# EAGLE schematic Main (EAGLE 9.6.2)
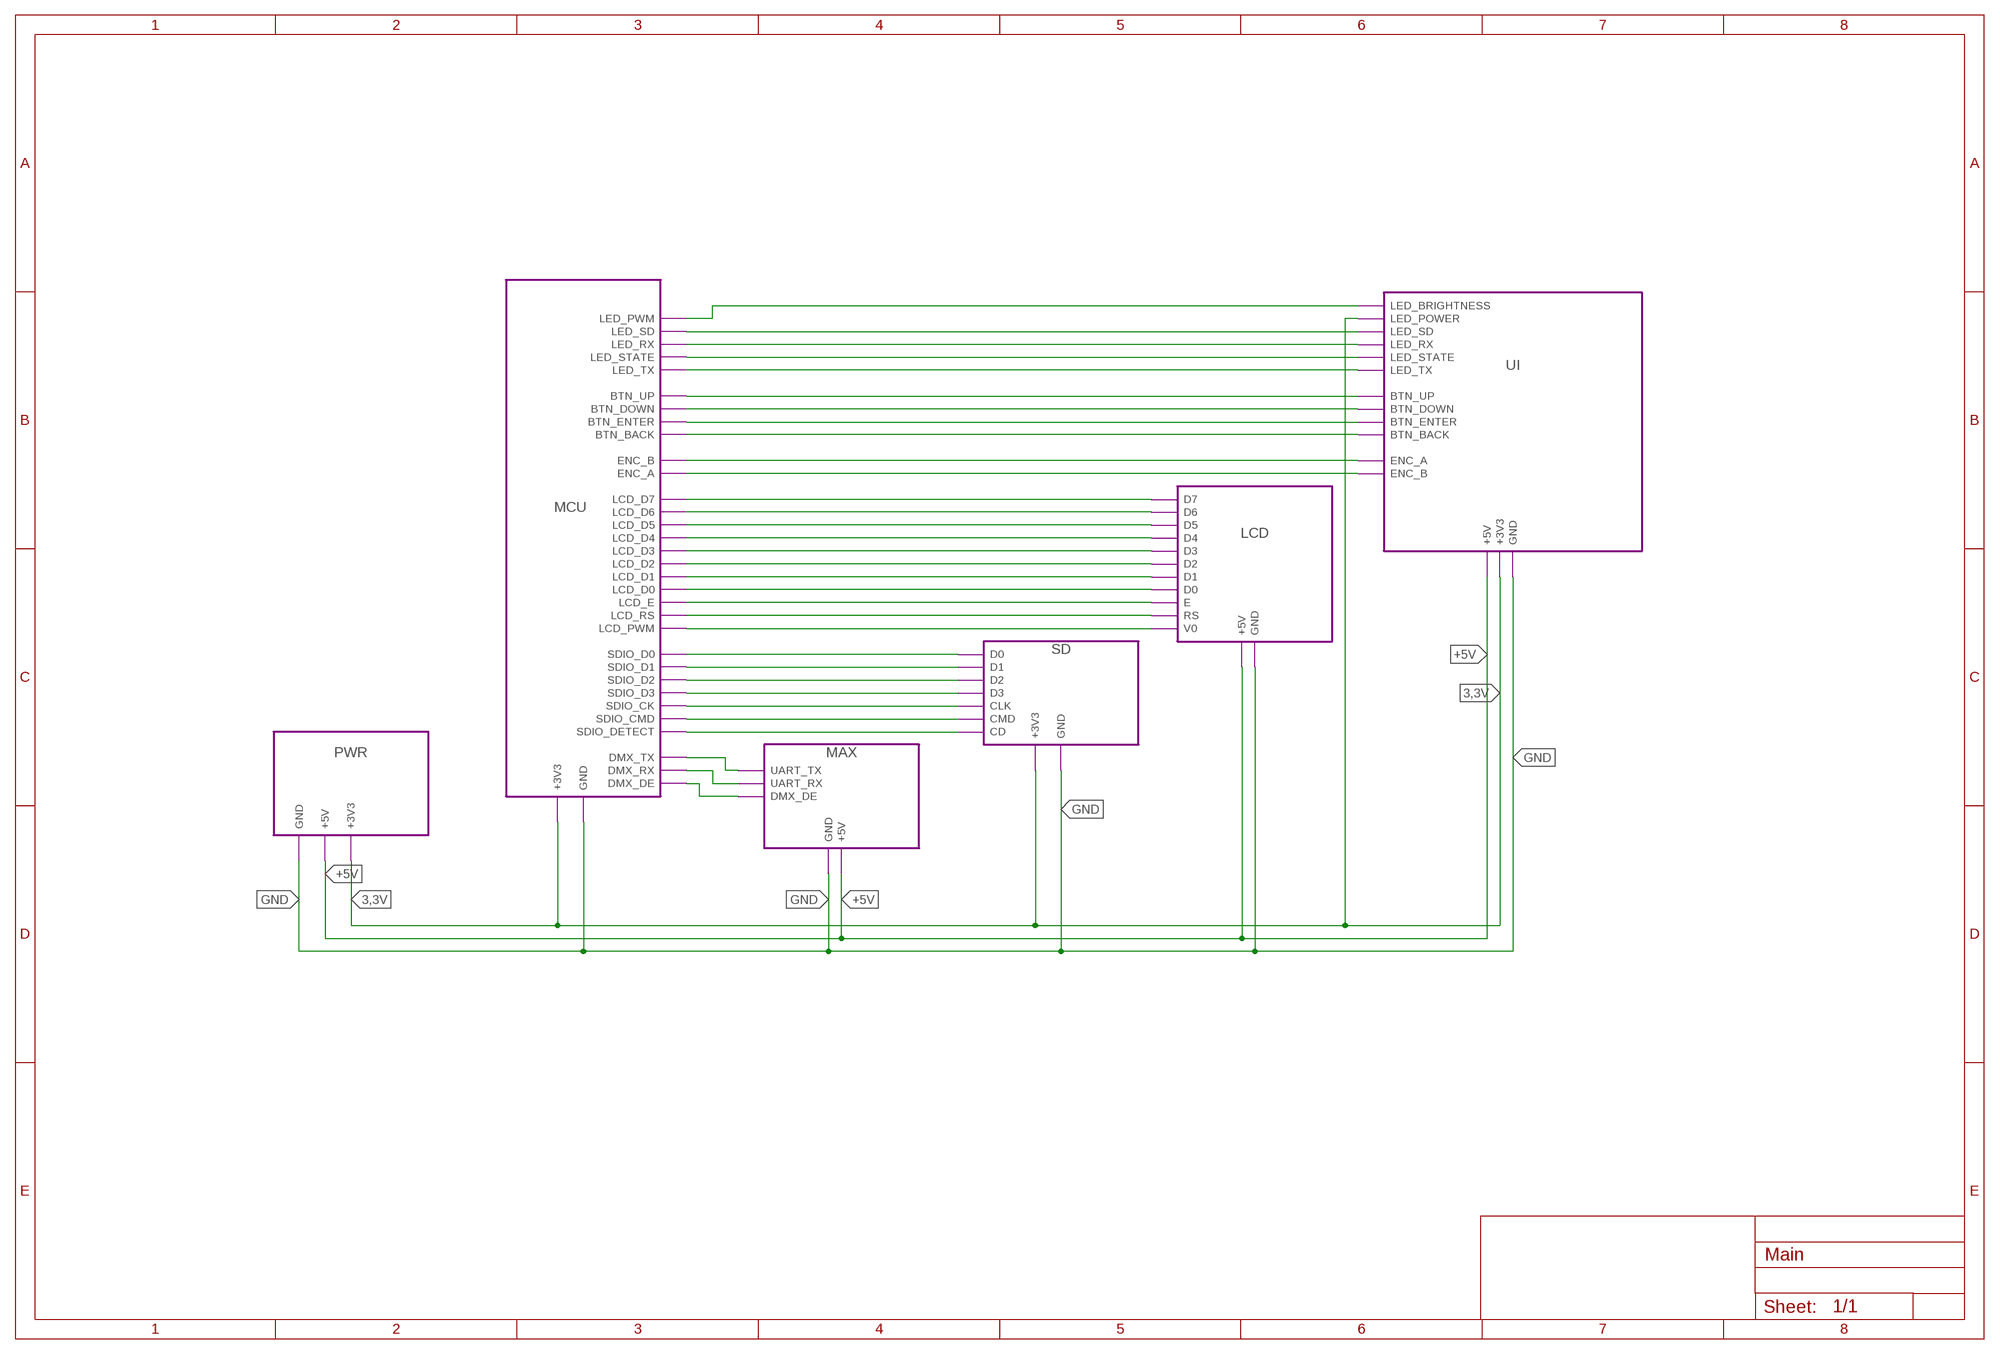
[diagram p0: schematic, sheet 1]

## Module instances
MAX = RS485
PWR = POWER
SD = SD
LCD = LCD
UI = GUI
MCU = F446ZE

## Nets
3,3V: port UI.LED_POWER UI.+3V3 PWR.+3V3 SD.+3V3 MCU.+3V3
+5V: port MAX.+5V UI.+5V LCD.+5V PWR.+5V
GND: port PWR.GND MAX.GND SD.GND UI.GND LCD.GND MCU.GND
N$1: port SD.CMD MCU.SDIO_CMD
N$2: port SD.CLK MCU.SDIO_CK
N$3: port SD.D3 MCU.SDIO_D3
N$4: port MAX.UART_RX MCU.DMX_RX
N$5: port MAX.UART_TX MCU.DMX_TX
N$6: port SD.D2 MCU.SDIO_D2
N$7: port SD.D1 MCU.SDIO_D1
N$8: port SD.D0 MCU.SDIO_D0
N$9: port LCD.V0 MCU.LCD_PWM
N$10: port UI.ENC_B MCU.ENC_A
N$11: port LCD.E MCU.LCD_E
N$12: port LCD.RS MCU.LCD_RS
N$13: port LCD.D0 MCU.LCD_D0
N$14: port LCD.D1 MCU.LCD_D1
N$15: port LCD.D4 MCU.LCD_D4
N$16: port LCD.D5 MCU.LCD_D5
N$17: port LCD.D6 MCU.LCD_D6
N$18: port LCD.D7 MCU.LCD_D7
N$19: port LCD.D2 MCU.LCD_D2
N$20: port LCD.D3 MCU.LCD_D3
N$21: port UI.ENC_A MCU.ENC_B
N$22: port UI.BTN_BACK MCU.BTN_BACK
N$23: port UI.BTN_ENTER MCU.BTN_ENTER
N$24: port UI.BTN_DOWN MCU.BTN_DOWN
N$25: port UI.BTN_UP MCU.BTN_UP
N$26: port MAX.DMX_DE MCU.DMX_DE
N$27: port UI.LED_STATE MCU.LED_STATE
N$28: port UI.LED_BRIGHTNESS MCU.LED_PWM
N$29: port UI.LED_TX MCU.LED_TX
N$30: port UI.LED_RX MCU.LED_RX
N$31: port UI.LED_SD MCU.LED_SD
N$32: port SD.CD MCU.SDIO_DETECT

## Library data of the parts

## Module RS485
Ports: UART_TX(in) UART_RX(out) GND(pwr) +5V(pwr) DMX_DE(in)
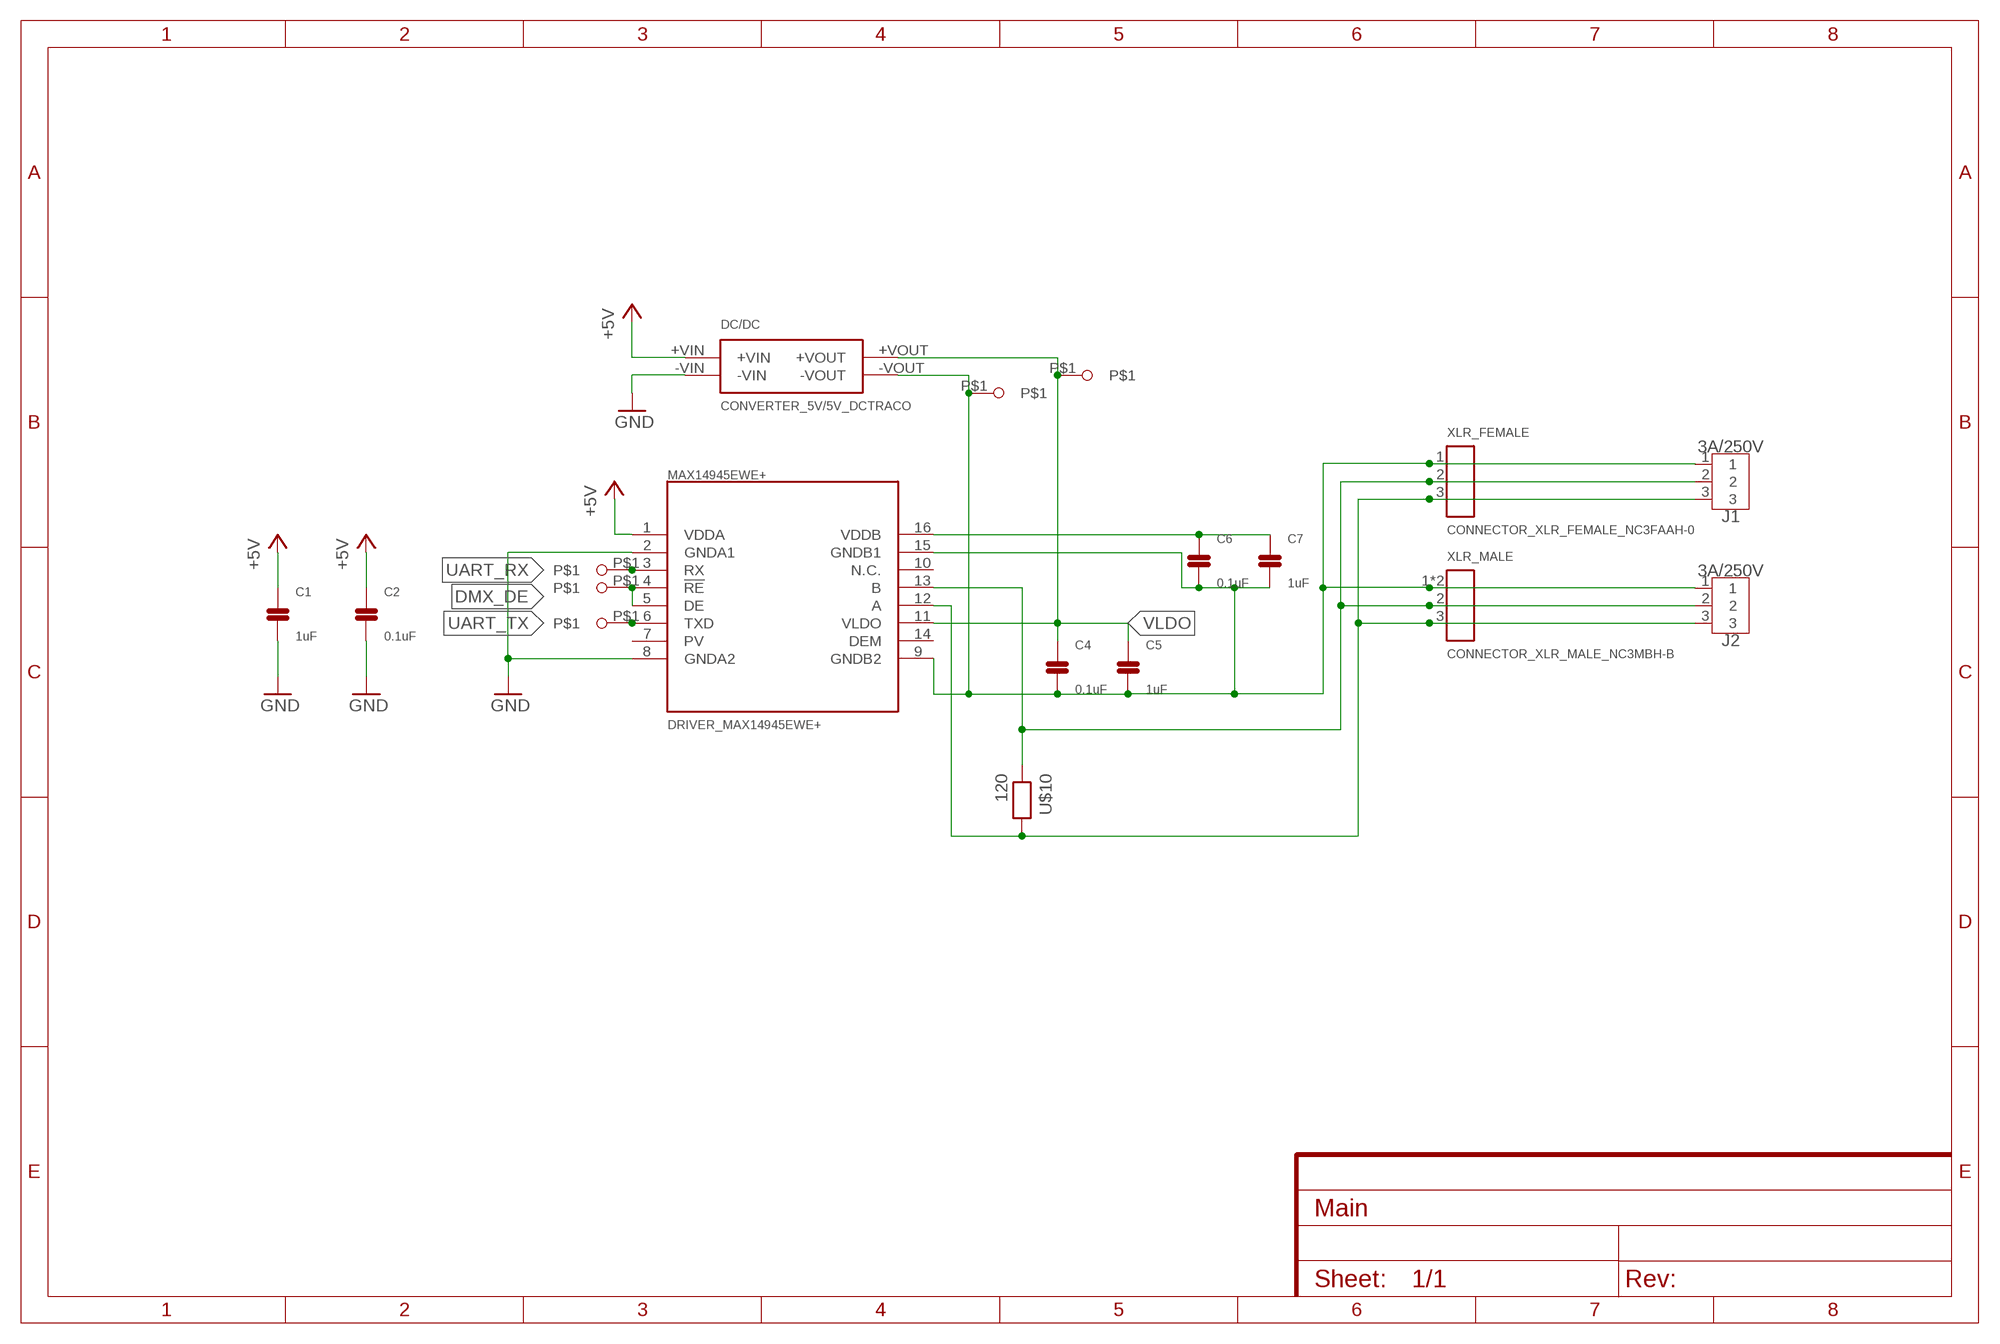
[diagram p1: schematic, module RS485, sheet 1]

### Parts
C1  1uF  CAP_SMD08055C104KAT2A  [CAPC2012X100N]
C2  0.1uF  CAP_SMDC0805C105K4RACTU  [CAPC2012X90N]
C4  0.1uF  CAP_SMDC0805C105K4RACTU  [CAPC2012X90N]
C5  1uF  CAP_SMD08055C104KAT2A  [CAPC2012X100N]
C6  0.1uF  CAP_SMDC0805C105K4RACTU  [CAPC2012X90N]
C7  1uF  CAP_SMD08055C104KAT2A  [CAPC2012X100N]
DC/DC  CONVERTER_5V/5V_DCTRACO  [5V/5V_DC_CONVERTER_TRACO]
J1  3A/250V  B3B-XH-A  [B3B-XH-A]
J2  3A/250V  B3B-XH-A  [B3B-XH-A]
MAX14945EWE+  DRIVER_MAX14945EWE+  DRIVER_MAX14941GWE+  [SOIC127P1032X265-16N]
U$2  MESSPUNKT  [MESSPUNKT]
U$3  MESSPUNKT  [MESSPUNKT]
U$4  MESSPUNKT  [MESSPUNKT]
U$5  MESSPUNKT  [MESSPUNKT]
U$6  MESSPUNKT  [MESSPUNKT]
U$10  120  RES_SMDCRG1206F120R  [RESC3115X56N]
XLR_FEMALE  CONNECTOR_XLR_FEMALE_NC3FAAH-0  [NC3FAAH-0]
XLR_MALE  CONNECTOR_XLR_MALE_NC3MBH-B  [NC3MBH-B]

### Nets
+5V: C1.1 C2.1 DC/DC.+VIN MAX14945EWE+.1(VDDA)
DMX_DE: MAX14945EWE+.4(!RE) MAX14945EWE+.5(DE) U$5.P$1
GND: C1.2 C2.2 DC/DC.-VIN MAX14945EWE+.2(GNDA1) MAX14945EWE+.8(GNDA2)
GNDB: C4.2 C5.2 C6.2 C7.2 DC/DC.-VOUT J1.1 J2.1 MAX14945EWE+.9(GNDB2) MAX14945EWE+.15(GNDB1) U$2.P$1 XLR_FEMALE.1 XLR_MALE.1 XLR_MALE.G
N$1: J1.3 J2.3 MAX14945EWE+.12(A) U$10.1 XLR_FEMALE.3 XLR_MALE.3
N$2: J1.2 J2.2 MAX14945EWE+.13(B) U$10.2 XLR_FEMALE.2 XLR_MALE.2
UART_RX: MAX14945EWE+.3(RX) U$6.P$1
UART_TX: MAX14945EWE+.6(TXD) U$4.P$1
VDDB: C6.1 C7.1 MAX14945EWE+.16(VDDB)
VLDO: C4.1 C5.1 DC/DC.+VOUT MAX14945EWE+.11(VLDO) U$3.P$1
Unconnected: MAX14945EWE+.7(PV) MAX14945EWE+.10(N.C.) MAX14945EWE+.14(DEM)

### Library data of the parts
C1 C5 C7 = BA Parts:CAP_SMD: SMD Kondenatoren; DATASHEET: https://docs.rs-online.com/babb/0900766b817076dd.pdf; PACKAGE: 0805 (2012M)
C2 C4 C6 = BA Parts:CAP_SMD: SMD Kondenatoren; DATASHEET: https://docs.rs-online.com/d3ac/0900766b802d4698.pdf; PACKAGE: 0805 (2012M)
DC/DC = BA Parts:CONVERTER_5V/5V_DC
J1 J2 = BA Parts:B3B-XH-A: XH Connector Top Entry - 3POS Details see: Datasheet <http://www.jst-mfg.com/product/pdf/eng/eXH.pdf>; CATEGORY: CONNECTOR; DESCRIPTION: 2.5mm pitch/disconnectable crimp style connector; MANUFACTURER: JST (XH connector); MPN: B3B-XH-A; PART_STATUS: ACTIVE; ROHS_COMPLIANT: COMPLIANT; SERIES: B3B-XH-A; SUB_CATEGORY: THROUGH HOLE CONNECTOR; TYPE: SIDE ENTRY
MAX14945EWE+ = BA Parts:DRIVER_MAX14941GWE+
U$2-U$6 = BA Parts:MESSPUNKT
U$10 = BA Parts:RES_SMD: SMD Widerstand; DATASHEET: https://docs.rs-online.com/2716/0900766b813e2403.pdf; PACKAGE: 1206 (3216M)
XLR_FEMALE = BA Parts:CONNECTOR_XLR_FEMALE_NC3FAAH-0
XLR_MALE = BA Parts:CONNECTOR_XLR_MALE_NC3MBH-B

## Module POWER
Ports: GND(io) +5V(io) +3V3(io)
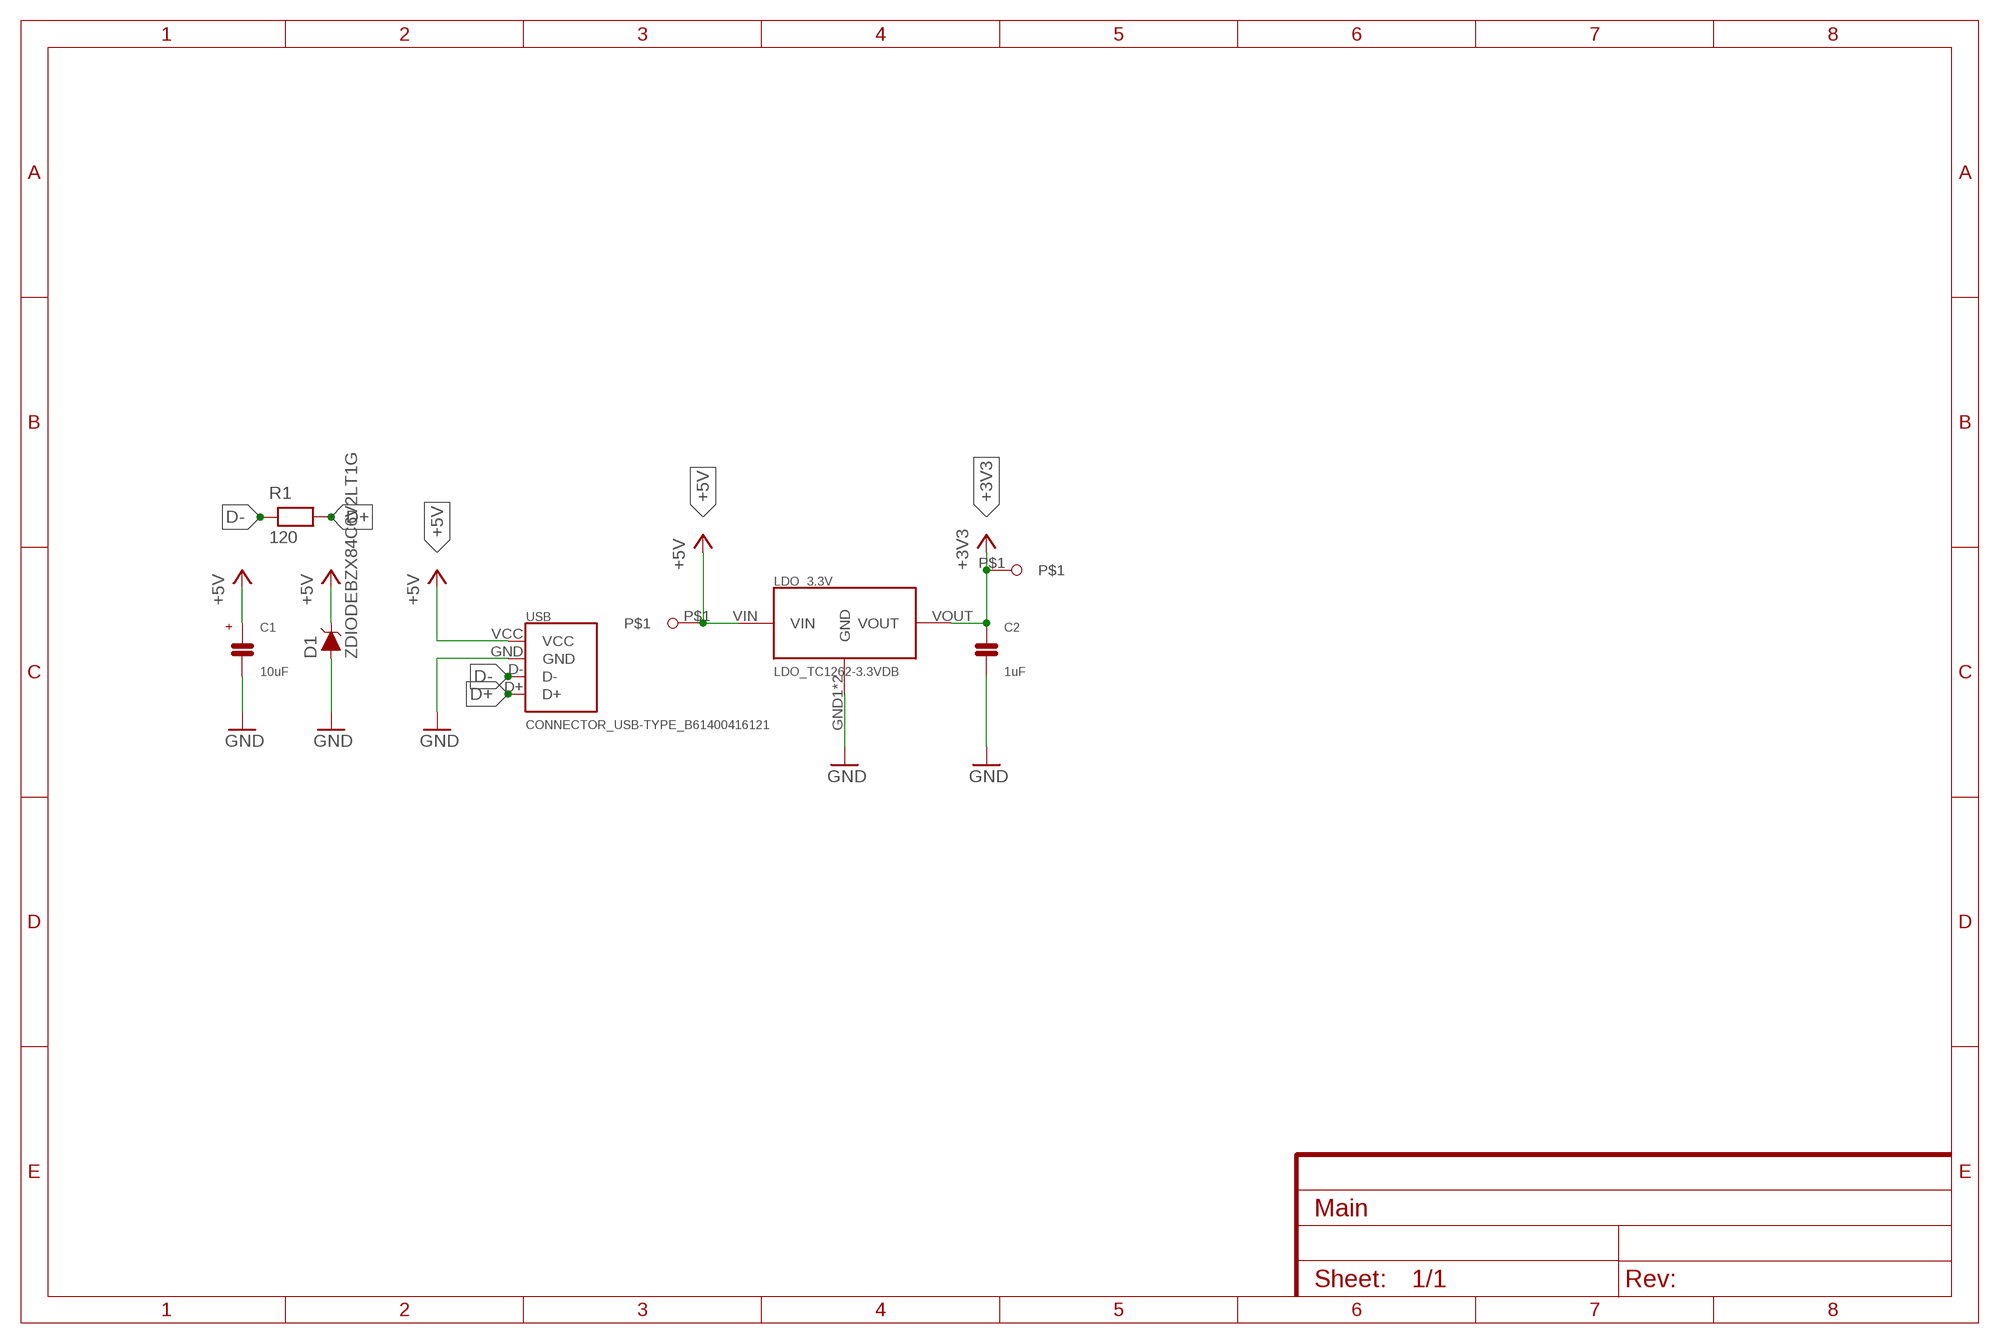
[diagram p2: schematic, module POWER, sheet 1]

### Parts
C1  10uF  CAP_ELEKTROLYTEEEFP1E100AR  [CAPAE430X610N]
C2  1uF  CAP_SMD08055C104KAT2A  [CAPC2012X100N]
D1  ZDIODEBZX84C6V2LT1G  [SOT65P237X111-3N]
LDO_3.3V  LDO_TC1262-3.3VDB  [SOT230P700X180-4N]
R1  120  RES_SMDCRG1206F120R  [RESC3115X56N]
U$5  MESSPUNKT  [MESSPUNKT]
U$6  MESSPUNKT  [MESSPUNKT]
USB  CONNECTOR_USB-TYPE_B61400416121  [USB-TYPE_B_CONNECTOR]

### Nets
+3V3: C2.1 LDO_3.3V.VOUT U$6.P$1
+5V: C1.1 D1.3(C) LDO_3.3V.VIN U$5.P$1 USB.VCC
D+: R1.1 USB.D+
D-: R1.2 USB.D-
GND: C1.2 C2.2 D1.1(A) LDO_3.3V.GND1(GND) LDO_3.3V.GND2(GND) USB.GND

### Library data of the parts
C1 = BA Parts:CAP_ELEKTROLYT; DATASHEET: https://docs.rs-online.com/d3dd/0900766b80df09a1.pdf
C2 = BA Parts:CAP_SMD: SMD Kondenatoren; DATASHEET: https://docs.rs-online.com/babb/0900766b817076dd.pdf; PACKAGE: 0805 (2012M)
D1 = BA Parts:ZDIODE
LDO_3.3V = BA Parts:LDO_TC1262-3.3VDB
R1 = BA Parts:RES_SMD: SMD Widerstand; DATASHEET: https://docs.rs-online.com/2716/0900766b813e2403.pdf; PACKAGE: 1206 (3216M)
U$5 U$6 = BA Parts:MESSPUNKT
USB = BA Parts:CONNECTOR_USB-TYPE_B; DATASHEET: https://docs.rs-online.com/8337/0900766b81023ab5.pdf

## Module SD
Ports: GND(io) D0(io) D1(io) D2(io) CLK(io) CMD(io) CD(io) D3(io) +3V3(io)
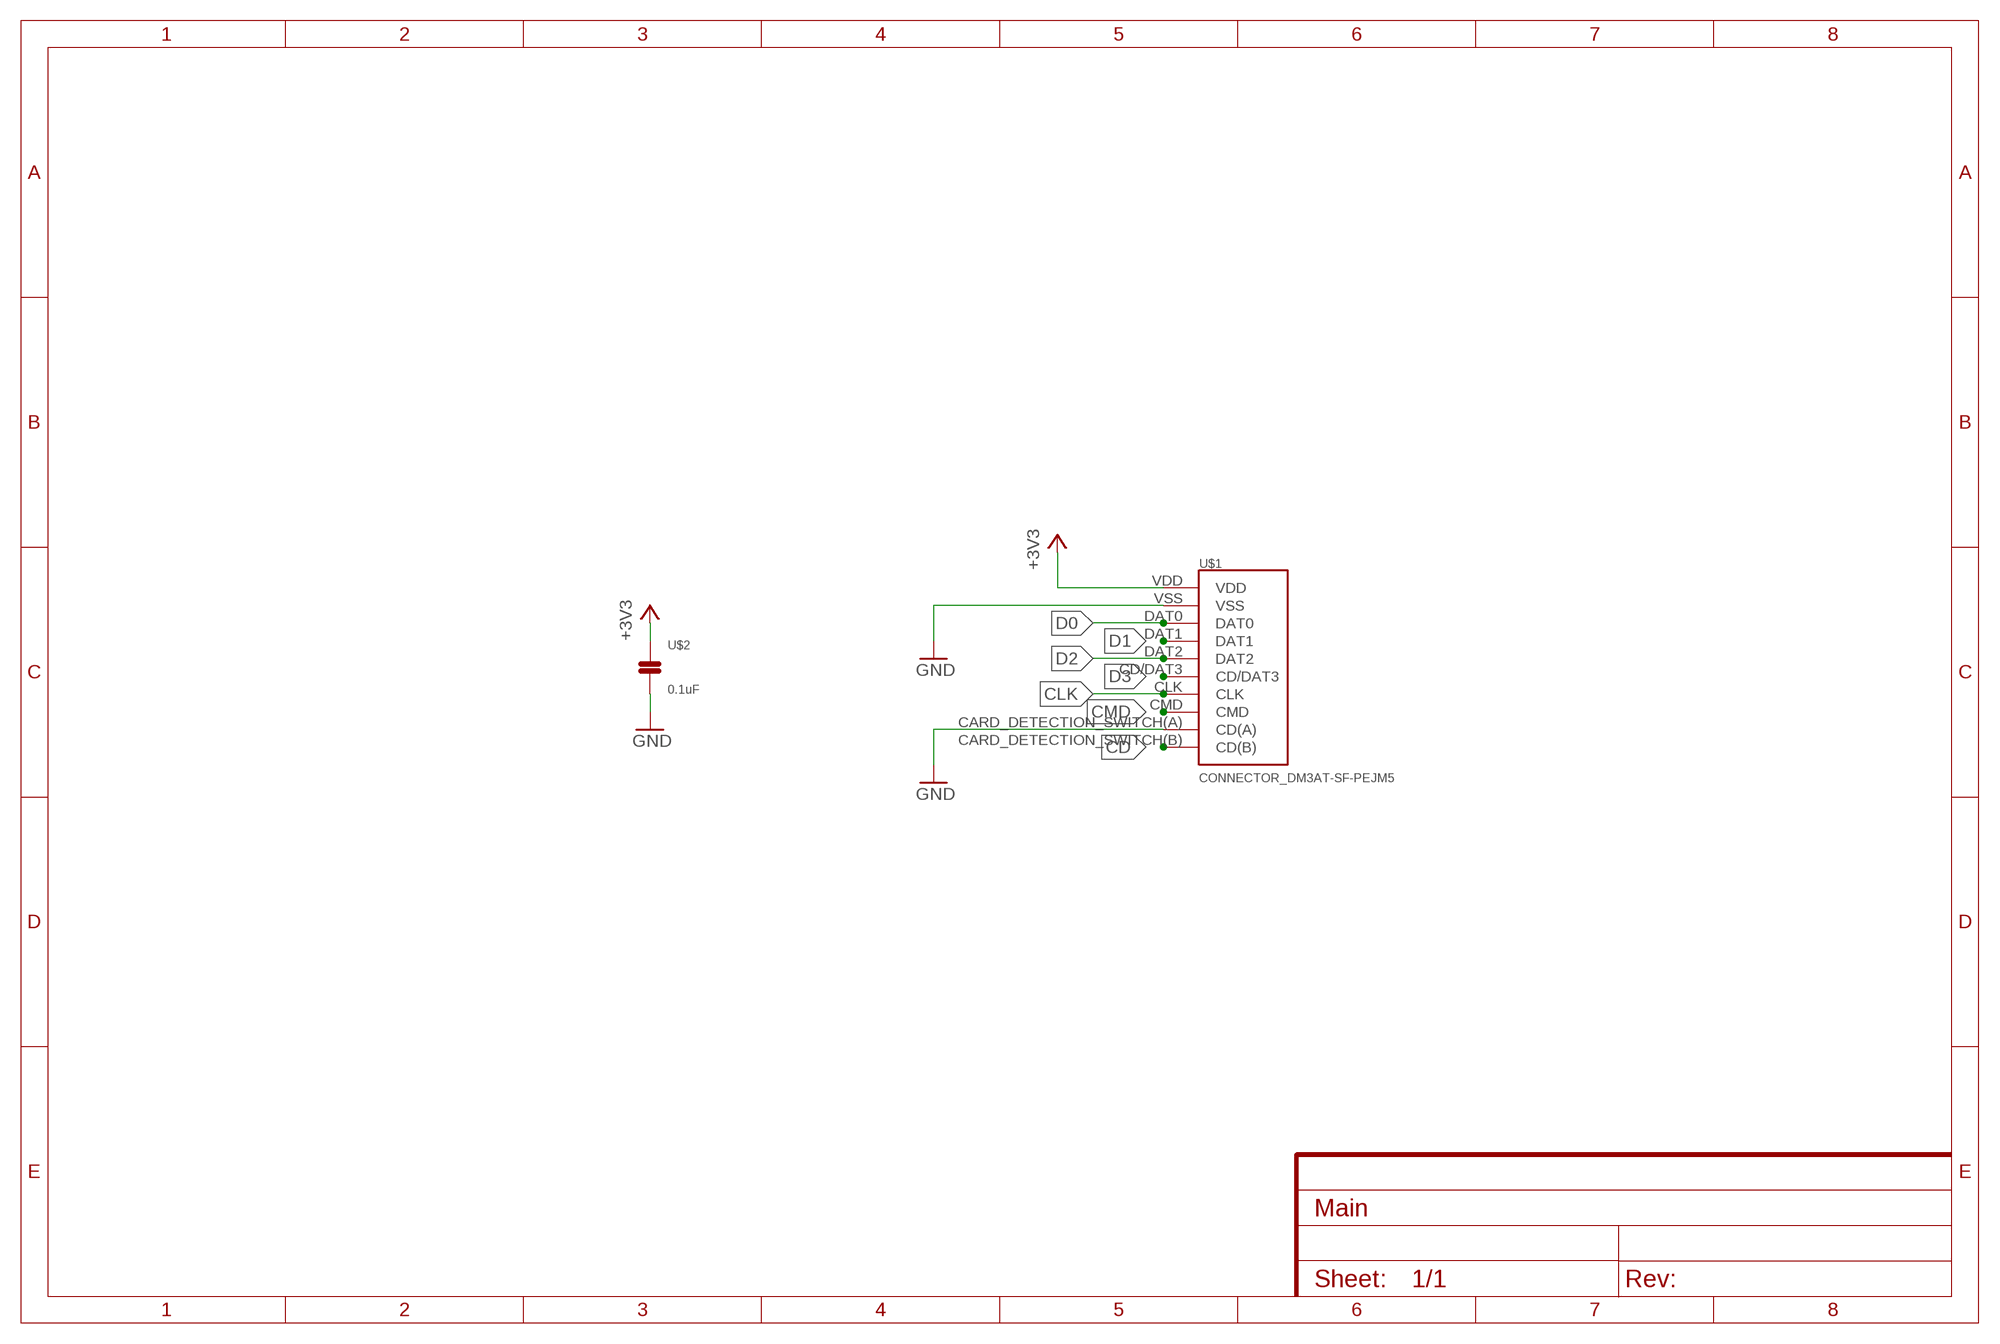
[diagram p3: schematic, module SD, sheet 1]

### Parts
U$1  CONNECTOR_DM3AT-SF-PEJM5  [DM3AT-SF-PEJM5]
U$2  0.1uF  CAP_SMDC0805C105K4RACTU  [CAPC2012X90N]

### Nets
+3V3: U$1.VDD U$2.1
CD: U$1.CARD_DETECTION_SWITCH(B)(CD(B))
CLK: U$1.CLK
CMD: U$1.CMD
D0: U$1.DAT0
D1: U$1.DAT1
D2: U$1.DAT2
D3: U$1.CD/DAT3
GND: U$1.CARD_DETECTION_SWITCH(A)(CD(A)) U$1.VSS U$2.2

### Library data of the parts
U$1 = BA Parts:CONNECTOR_DM3AT-SF-PEJM5
U$2 = BA Parts:CAP_SMD: SMD Kondenatoren; DATASHEET: https://docs.rs-online.com/d3ac/0900766b802d4698.pdf; PACKAGE: 0805 (2012M)

## Module LCD
Ports: D7(io) D6(io) D5(io) D4(io) E(io) RS(io) V0(io) D3(io) D2(io) D1(io) D0(io) +5V(io) GND(io)
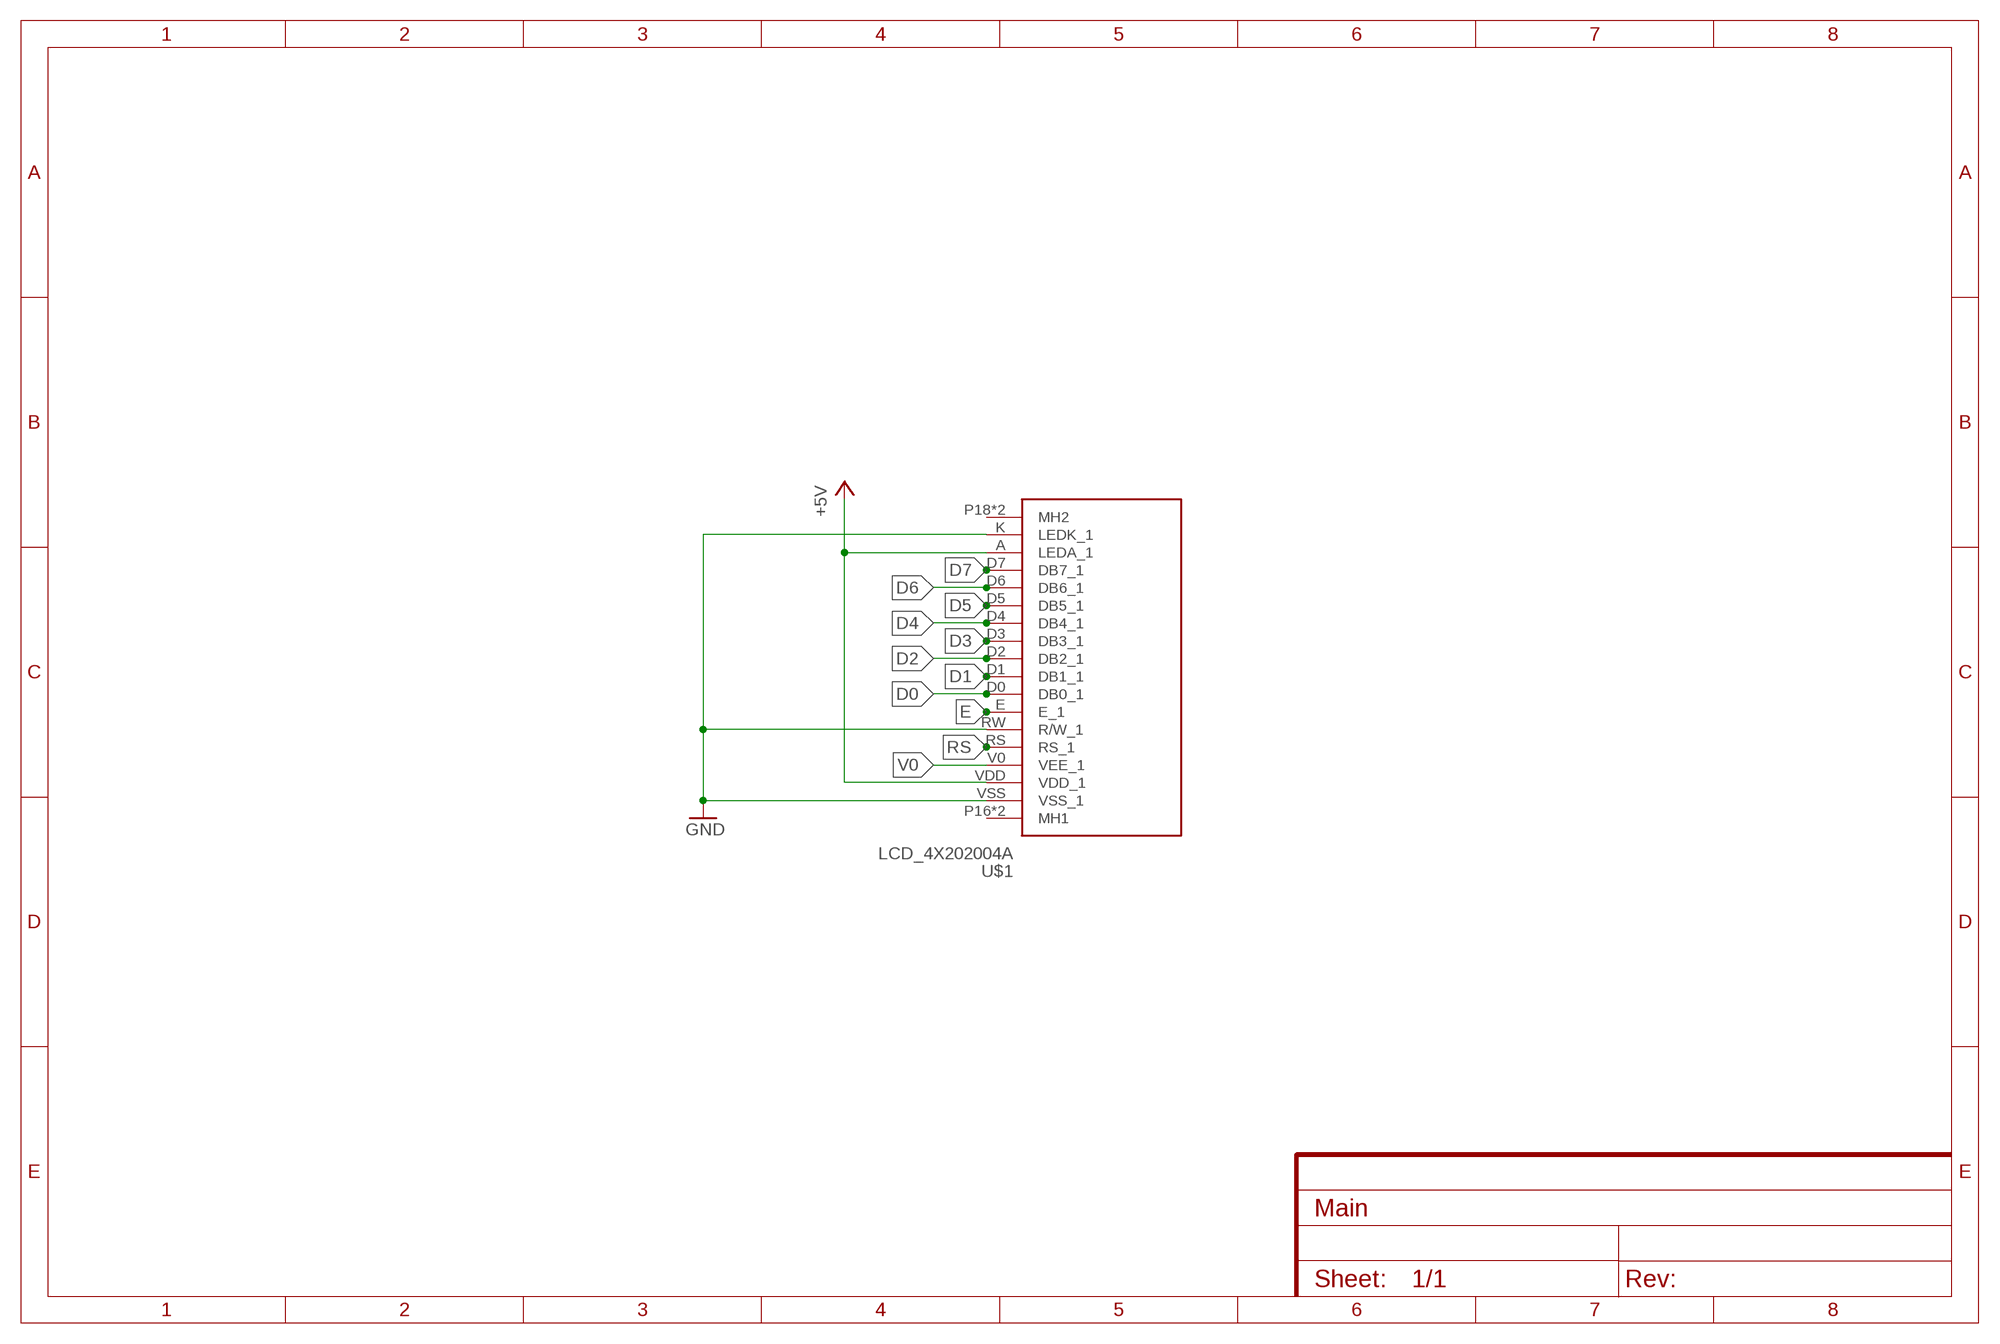
[diagram p4: schematic, module LCD, sheet 1]

### Parts
U$1  LCD_4X202004A  [LCD]

### Nets
+5V: U$1.A(LEDA_1) U$1.VDD(VDD_1)
D0: U$1.D0(DB0_1)
D1: U$1.D1(DB1_1)
D2: U$1.D2(DB2_1)
D3: U$1.D3(DB3_1)
D4: U$1.D4(DB4_1)
D5: U$1.D5(DB5_1)
D6: U$1.D6(DB6_1)
D7: U$1.D7(DB7_1)
E: U$1.E(E_1)
GND: U$1.K(LEDK_1) U$1.RW(R/W_1) U$1.VSS(VSS_1)
RS: U$1.RS(RS_1)
V0: U$1.V0(VEE_1)
Unconnected: U$1.P16(MH1) U$1.P17(MH1) U$1.P18(MH2) U$1.P19(MH2)

### Library data of the parts
U$1 = BA Parts:LCD_4X20

## Module GUI
Ports: BTN_UP(io) BTN_DOWN(io) BTN_ENTER(io) BTN_BACK(io) ENC_A(io) ENC_B(io) GND(io) LED_POWER(io) LED_RX(io) LED_STATE(io) LED_TX(io) LED_SD(io) LED_BRIGHTNESS(io) +5V(io) +3V3(io)
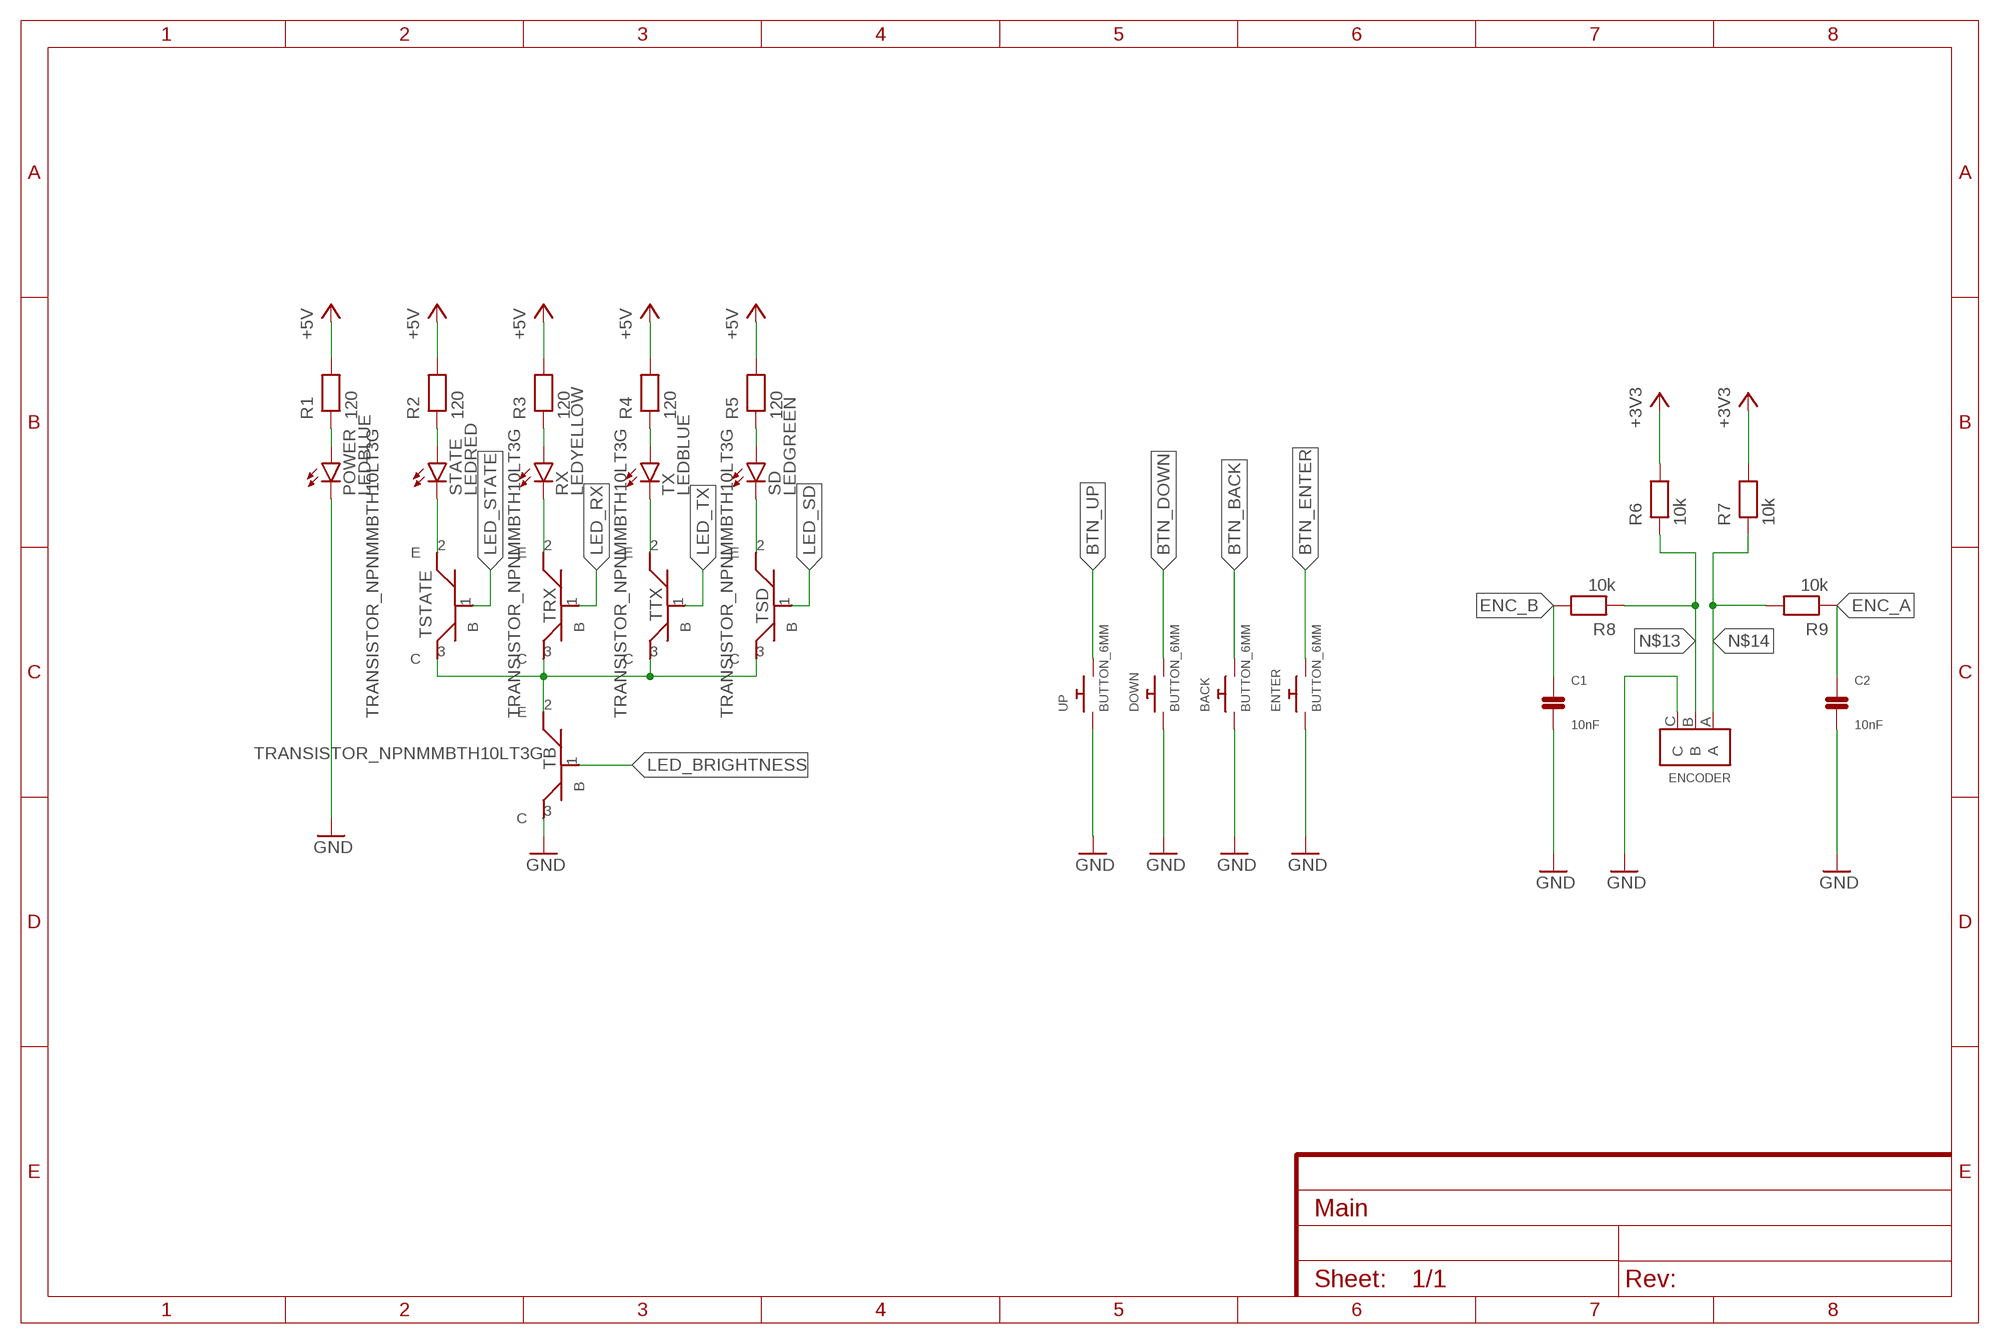
[diagram p5: schematic, module GUI, sheet 1]

### Parts
BACK  BUTTON_6MM  [TACTILE_SWITCH_PTH_6.0MM]
C1  10nF  CAP_SMDVJ0805Y103KXBAC  [CAPC2012X145N]
C2  10nF  CAP_SMDVJ0805Y103KXBAC  [CAPC2012X145N]
DOWN  BUTTON_6MM  [TACTILE_SWITCH_PTH_6.0MM]
ENCODER  ENCODER  [EC12E2420404]
ENTER  BUTTON_6MM  [TACTILE_SWITCH_PTH_6.0MM]
POWER  LEDBLUE  [LED_5MM_BLUE]
R1  120  RES_SMDCRG1206F120R  [RESC3115X56N]
R2  120  RES_SMDCRG1206F120R  [RESC3115X56N]
R3  120  RES_SMDCRG1206F120R  [RESC3115X56N]
R4  120  RES_SMDCRG1206F120R  [RESC3115X56N]
R5  120  RES_SMDCRG1206F120R  [RESC3115X56N]
R6  10k  RES_SMDCRCW080510K0FKEAHP  [RESC1608X55N]
R7  10k  RES_SMDCRCW080510K0FKEAHP  [RESC1608X55N]
R8  10k  RES_SMDCRCW080510K0FKEAHP  [RESC1608X55N]
R9  10k  RES_SMDCRCW080510K0FKEAHP  [RESC1608X55N]
RX  LEDYELLOW  [LED_5MM_YELLOW]
SD  LEDGREEN  [LED_5MM_GREEN]
STATE  LEDRED  [LED_5MM_RED]
TB  TRANSISTOR_NPNMMBTH10LT3G  [SOT95P237X111-3N]
TRX  TRANSISTOR_NPNMMBTH10LT3G  [SOT95P237X111-3N]
TSD  TRANSISTOR_NPNMMBTH10LT3G  [SOT95P237X111-3N]
TSTATE  TRANSISTOR_NPNMMBTH10LT3G  [SOT95P237X111-3N]
TTX  TRANSISTOR_NPNMMBTH10LT3G  [SOT95P237X111-3N]
TX  LEDBLUE  [LED_5MM_BLUE]
UP  BUTTON_6MM  [TACTILE_SWITCH_PTH_6.0MM]

### Nets
+3V3: R6.1 R7.1
+5V: R1.1 R2.1 R3.1 R4.1 R5.1
BTN_BACK: BACK.3 BACK.4
BTN_DOWN: DOWN.3 DOWN.4
BTN_ENTER: ENTER.3 ENTER.4
BTN_UP: UP.3 UP.4
ENC_A: C2.1 R9.2
ENC_B: C1.1 R8.1
GND: BACK.1 BACK.2 C1.2 C2.2 DOWN.1 DOWN.2 ENCODER.C ENTER.1 ENTER.2 POWER.2(C) TB.3(C) UP.1 UP.2
LED_BRIGHTNESS: TB.1(B)
LED_RX: TRX.1(B)
LED_SD: TSD.1(B)
LED_STATE: TSTATE.1(B)
LED_TX: TTX.1(B)
N$1: POWER.1(A) R1.2
N$2: R2.2 STATE.1(A)
N$3: R3.2 RX.1(A)
N$4: R4.2 TX.1(A)
N$7: R5.2 SD.1(A)
N$8: TB.2(E) TRX.3(C) TSD.3(C) TSTATE.3(C) TTX.3(C)
N$9: STATE.2(C) TSTATE.2(E)
N$10: RX.2(C) TRX.2(E)
N$11: TTX.2(E) TX.2(C)
N$12: SD.2(C) TSD.2(E)
N$13: ENCODER.B R6.2 R8.2
N$14: ENCODER.A R7.2 R9.1

### Library data of the parts
BACK DOWN ENTER UP = BA Parts:BUTTON_6MM
C1 C2 = BA Parts:CAP_SMD: SMD Kondenatoren; DATASHEET: https://docs.rs-online.com/16fc/0900766b80117c5f.pdf; PACKAGE: 0805 (2012M)
ENCODER = BA Parts:ENCODER
POWER RX SD STATE TX = BA Parts:LED
R1-R5 = BA Parts:RES_SMD: SMD Widerstand; DATASHEET: https://docs.rs-online.com/2716/0900766b813e2403.pdf; PACKAGE: 1206 (3216M)
R6-R9 = BA Parts:RES_SMD: SMD Widerstand; DATASHEET: https://docs.rs-online.com/e925/0900766b814c54cb.pdf; PACKAGE: 0805 (2012M)
TB TRX TSD TSTATE TTX = BA Parts:TRANSISTOR_NPN

## Module F446ZE
Ports: DMX_DE(io) DMX_RX(io) DMX_TX(io) SDIO_CMD(io) SDIO_CK(io) SDIO_D3(io) SDIO_D2(io) SDIO_D1(io) SDIO_D0(io) LCD_RS(io) LCD_E(io) LCD_D0(io) LCD_D1(io) LCD_D2(io) LCD_D3(io) LCD_D4(io) LCD_D5(io) LCD_D6(io) LCD_D7(io) ENC_A(io) ENC_B(io) BTN_BACK(io) BTN_ENTER(io) BTN_DOWN(io) BTN_UP(io) LED_TX(io) LED_STATE(io) LED_RX(io) LED_SD(io) LCD_PWM(io) LED_PWM(io) GND(io) +3V3(io) SDIO_DETECT(io)
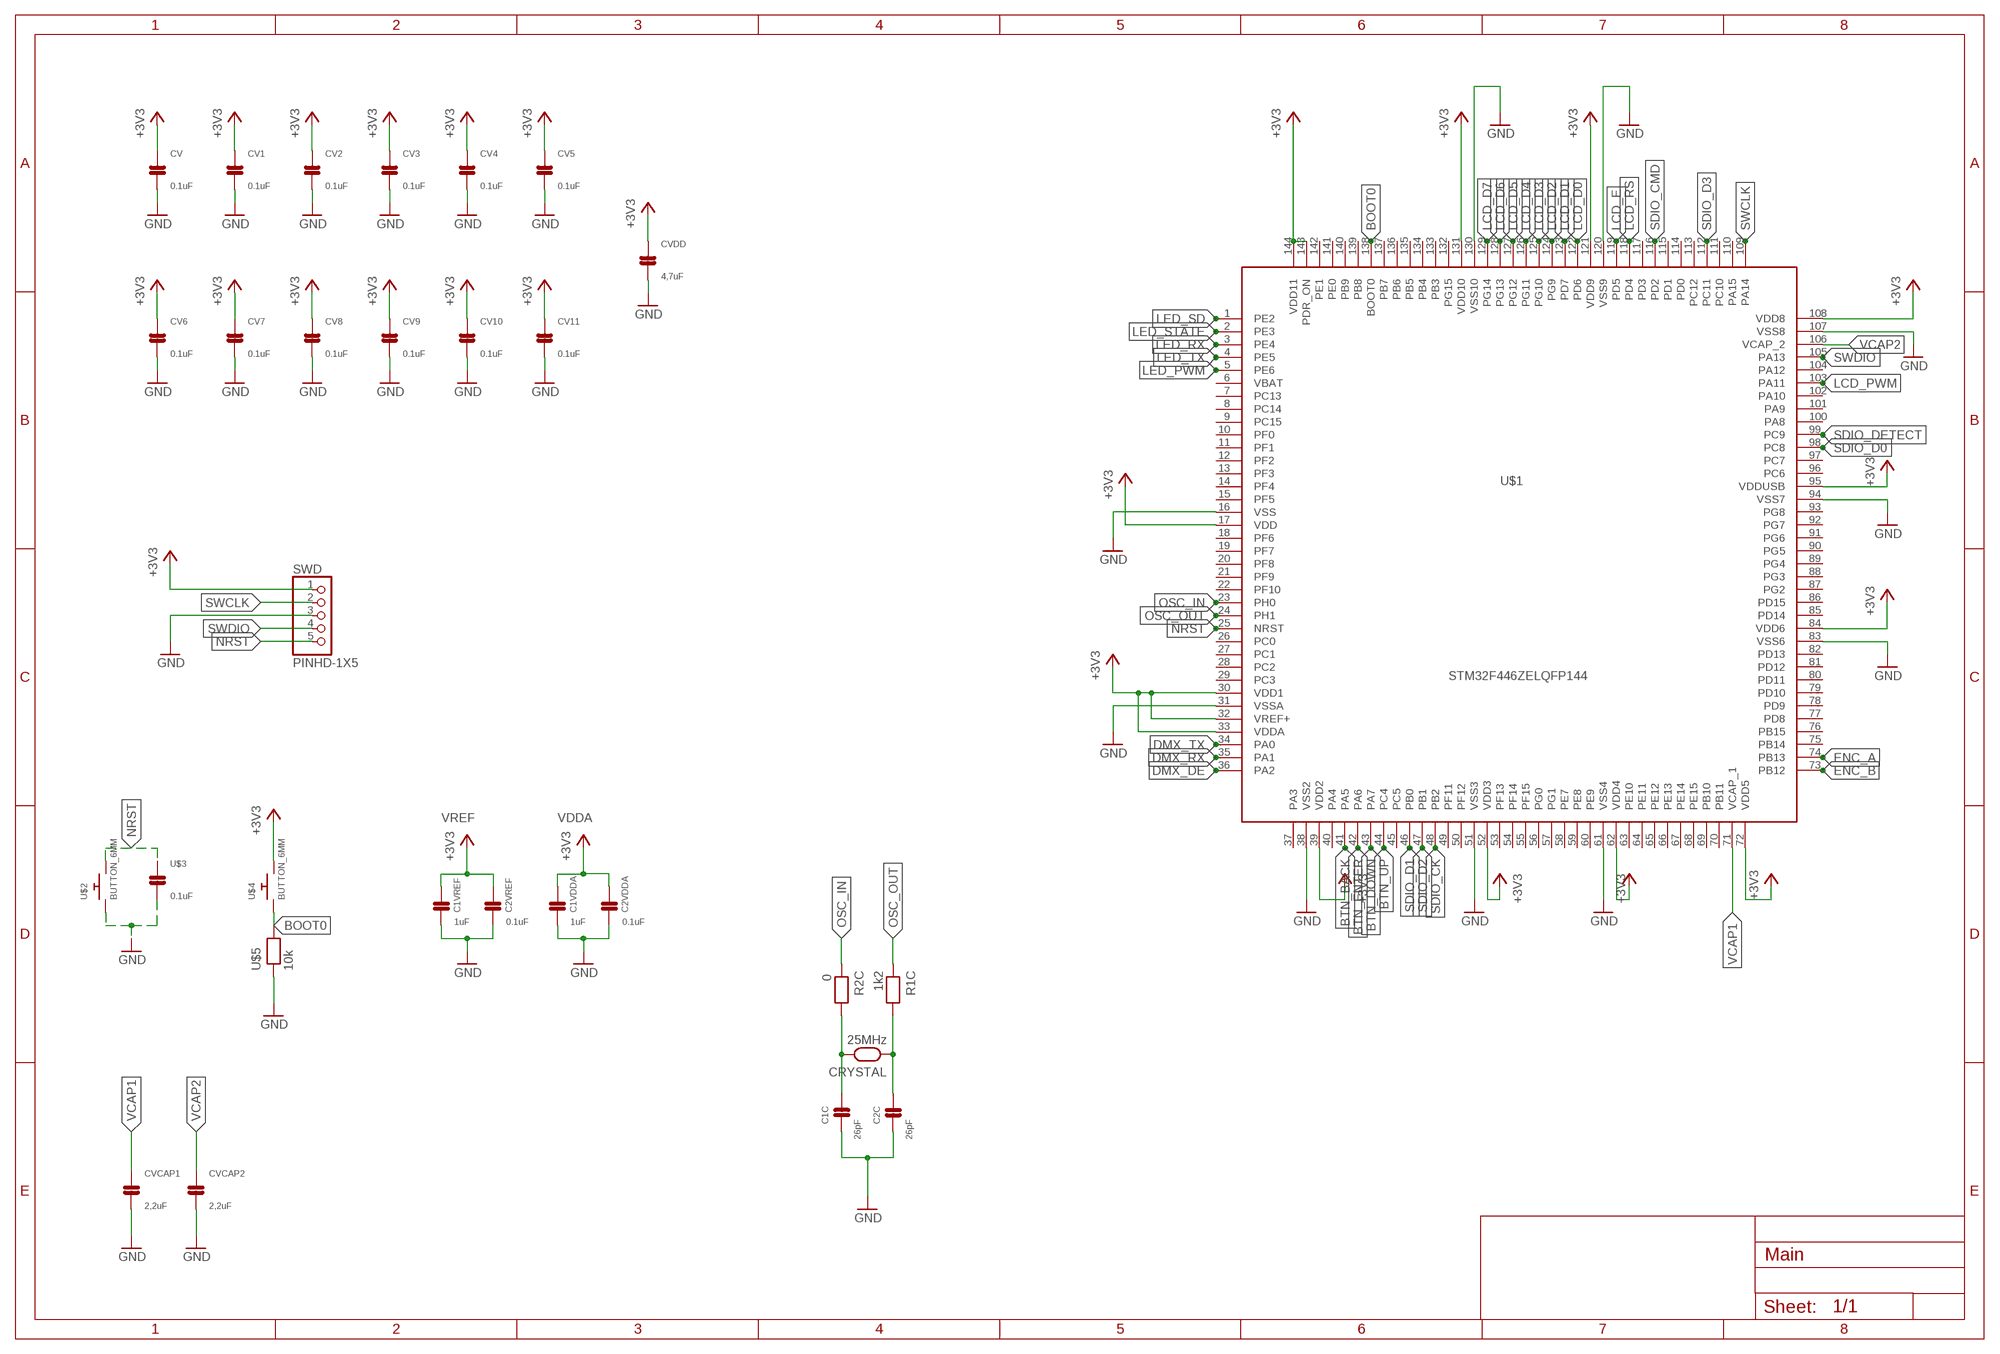
[diagram p6: schematic, module F446ZE, sheet 1]

### Parts
C1C  26pF  CAP_SMDVJ0603A150JXBAC  [CAPC1608X97N]
C1VDDA  1uF  CAP_SMD08055C104KAT2A  [CAPC2012X100N]
C1VREF  1uF  CAP_SMD08055C104KAT2A  [CAPC2012X100N]
C2C  26pF  CAP_SMDVJ0603A150JXBAC  [CAPC1608X97N]
C2VDDA  0.1uF  CAP_SMDC0805C105K4RACTU  [CAPC2012X90N]
C2VREF  0.1uF  CAP_SMDC0805C105K4RACTU  [CAPC2012X90N]
CRYSTAL  25MHz  CRYSTAL_VJ0603A150JXBACVJ0603A150JXBAC  [XTALRR488W43L1077T434H350B]
CV  0.1uF  CAP_SMDC0805C105K4RACTU  [CAPC2012X90N]
CV1  0.1uF  CAP_SMDC0805C105K4RACTU  [CAPC2012X90N]
CV2  0.1uF  CAP_SMDC0805C105K4RACTU  [CAPC2012X90N]
CV3  0.1uF  CAP_SMDC0805C105K4RACTU  [CAPC2012X90N]
CV4  0.1uF  CAP_SMDC0805C105K4RACTU  [CAPC2012X90N]
CV5  0.1uF  CAP_SMDC0805C105K4RACTU  [CAPC2012X90N]
CV6  0.1uF  CAP_SMDC0805C105K4RACTU  [CAPC2012X90N]
CV7  0.1uF  CAP_SMDC0805C105K4RACTU  [CAPC2012X90N]
CV8  0.1uF  CAP_SMDC0805C105K4RACTU  [CAPC2012X90N]
CV9  0.1uF  CAP_SMDC0805C105K4RACTU  [CAPC2012X90N]
CV10  0.1uF  CAP_SMDC0805C105K4RACTU  [CAPC2012X90N]
CV11  0.1uF  CAP_SMDC0805C105K4RACTU  [CAPC2012X90N]
CVCAP1  2,2uF  CAP_SMDC0603C225K4PACTU  [CAPC1608X90N]
CVCAP2  2,2uF  CAP_SMDC0603C225K4PACTU  [CAPC1608X90N]
CVDD  4,7uF  CAP_SMDC0805C475M8RACAUTO  [CAPC2012X140N]
R1C  1k2  RES_SMDCRCW080510K0FKEAHP  [RESC1608X55N]
R2C  0  RES_SMDCRCW080510K0FKEAHP  [RESC1608X55N]
SWD  PINHD-1X5  [1X05]
U$1  STM32F446ZELQFP144  [QFP50P2200X2200X160-144N]
U$2  BUTTON_6MM  [TACTILE_SWITCH_PTH_6.0MM]
U$3  0.1uF  CAP_SMDC0805C105K4RACTU  [CAPC2012X90N]
U$4  BUTTON_6MM  [TACTILE_SWITCH_PTH_6.0MM]
U$5  10k  RES_SMDCRCW080510K0FKEAHP  [RESC1608X55N]

### Nets
+3V3: C1VDDA.1 C1VREF.1 C2VDDA.1 C2VREF.1 CV1.1 CV2.1 CV3.1 CV4.1 CV5.1 CV6.1 CV7.1 CV8.1 CV9.1 CV10.1 CV11.1 CV.1 CVDD.1 SWD.1 U$1.17(VDD) U$1.30(VDD1) U$1.32(VREF+) U$1.33(VDDA) U$1.39(VDD2) U$1.52(VDD3) U$1.62(VDD4) U$1.72(VDD5) U$1.84(VDD6) U$1.95(VDDUSB) U$1.108(VDD8) U$1.121(VDD9) U$1.131(VDD10) U$1.143(PDR_ON) U$1.144(VDD11) U$4.3 U$4.4
BOOT0: U$1.138(BOOT0) U$4.1 U$4.2 U$5.1
BTN_BACK: U$1.41(PA5)
BTN_DOWN: U$1.43(PA7)
BTN_ENTER: U$1.42(PA6)
BTN_UP: U$1.44(PC4)
DMX_DE: U$1.36(PA2)
DMX_RX: U$1.35(PA1)
DMX_TX: U$1.34(PA0)
ENC_A: U$1.74(PB13)
ENC_B: U$1.73(PB12)
GND: C1C.1 C1VDDA.2 C1VREF.2 C2C.2 C2VDDA.2 C2VREF.2 CV1.2 CV2.2 CV3.2 CV4.2 CV5.2 CV6.2 CV7.2 CV8.2 CV9.2 CV10.2 CV11.2 CV.2 CVCAP1.2 CVCAP2.2 CVDD.2 SWD.3 U$1.16(VSS) U$1.31(VSSA) U$1.38(VSS2) U$1.51(VSS3) U$1.61(VSS4) U$1.83(VSS6) U$1.94(VSS7) U$1.107(VSS8) U$1.120(VSS9) U$1.130(VSS10) U$2.1 U$2.2 U$3.2 U$5.2
LCD_D0: U$1.122(PD6)
LCD_D1: U$1.123(PD7)
LCD_D2: U$1.124(PG9)
LCD_D3: U$1.125(PG10)
LCD_D4: U$1.126(PG11)
LCD_D5: U$1.127(PG12)
LCD_D6: U$1.128(PG13)
LCD_D7: U$1.129(PG14)
LCD_E: U$1.119(PD5)
LCD_PWM: U$1.103(PA11)
LCD_RS: U$1.118(PD4)
LED_PWM: U$1.5(PE6)
LED_RX: U$1.3(PE4)
LED_SD: U$1.1(PE2)
LED_STATE: U$1.2(PE3)
LED_TX: U$1.4(PE5)
N$2: C1C.2 CRYSTAL.1 R2C.1
N$6: C2C.1 CRYSTAL.2 R1C.1
NRST: SWD.5 U$1.25(NRST) U$2.3 U$2.4 U$3.1
OSC_IN: R2C.2 U$1.23(PH0)
OSC_OUT: R1C.2 U$1.24(PH1)
SDIO_CK: U$1.48(PB2)
SDIO_CMD: U$1.116(PD2)
SDIO_D0: U$1.98(PC8)
SDIO_D1: U$1.46(PB0)
SDIO_D2: U$1.47(PB1)
SDIO_D3: U$1.112(PC11)
SDIO_DETECT: U$1.99(PC9)
SWCLK: SWD.2 U$1.109(PA14)
SWDIO: SWD.4 U$1.105(PA13)
VCAP1: CVCAP1.1 U$1.71(VCAP_1)
VCAP2: CVCAP2.1 U$1.106(VCAP_2)
Unconnected: U$1.6(VBAT) U$1.7(PC13) U$1.8(PC14) U$1.9(PC15) U$1.10(PF0) U$1.11(PF1) U$1.12(PF2) U$1.13(PF3) U$1.14(PF4) U$1.15(PF5) U$1.18(PF6) U$1.19(PF7) U$1.20(PF8) U$1.21(PF9) U$1.22(PF10) U$1.26(PC0) U$1.27(PC1) U$1.28(PC2) U$1.29(PC3) U$1.37(PA3) U$1.40(PA4) U$1.45(PC5) U$1.49(PF11) U$1.50(PF12) U$1.53(PF13) U$1.54(PF14) U$1.55(PF15) U$1.56(PG0) U$1.57(PG1) U$1.58(PE7) U$1.59(PE8) U$1.60(PE9) U$1.63(PE10) U$1.64(PE11) U$1.65(PE12) U$1.66(PE13) U$1.67(PE14) U$1.68(PE15) U$1.69(PB10) U$1.70(PB11) U$1.75(PB14) U$1.76(PB15) U$1.77(PD8) U$1.78(PD9) U$1.79(PD10) U$1.80(PD11) U$1.81(PD12) U$1.82(PD13) U$1.85(PD14) U$1.86(PD15) U$1.87(PG2) U$1.88(PG3) U$1.89(PG4) U$1.90(PG5) U$1.91(PG6) U$1.92(PG7) U$1.93(PG8) U$1.96(PC6) U$1.97(PC7) U$1.100(PA8) U$1.101(PA9) U$1.102(PA10) U$1.104(PA12) U$1.110(PA15) U$1.111(PC10) U$1.113(PC12) U$1.114(PD0) U$1.115(PD1) U$1.117(PD3) U$1.132(PG15) U$1.133(PB3) U$1.134(PB4) U$1.135(PB5) U$1.136(PB6) U$1.137(PB7) U$1.139(PB8) U$1.140(PB9) U$1.141(PE0) U$1.142(PE1)

### Notes on the sheet
- VREF | VDDA

### Library data of the parts
C1C C2C = BA Parts:CAP_SMD: SMD Kondenatoren; DATASHEET: https://docs.rs-online.com/16fc/0900766b80117c5f.pdf; PACKAGE: 0603; VALUE: 15pF
C1VDDA C1VREF = BA Parts:CAP_SMD: SMD Kondenatoren; DATASHEET: https://docs.rs-online.com/babb/0900766b817076dd.pdf; PACKAGE: 0805 (2012M)
C2VDDA C2VREF CV CV1-CV11 U$3 = BA Parts:CAP_SMD: SMD Kondenatoren; DATASHEET: https://docs.rs-online.com/d3ac/0900766b802d4698.pdf; PACKAGE: 0805 (2012M)
CRYSTAL = BA Parts:CRYSTAL_VJ0603A150JXBAC; DATASHEET: https://docs.rs-online.com/4d75/0900766b80dbbbbd.pdf; FREQ: 25MHz
CVCAP1 CVCAP2 = BA Parts:CAP_SMD: SMD Kondenatoren; DATASHEET: https://docs.rs-online.com/abc5/0900766b816ffde5.pdf; PACKAGE: 0603 (1608M)
CVDD = BA Parts:CAP_SMD: SMD Kondenatoren; DATASHEET: https://docs.rs-online.com/089c/0900766b81707569.pdf; PACKAGE: 0805 (2012M)
R1C R2C = BA Parts:RES_SMD: SMD Widerstand; DATASHEET: https://docs.rs-online.com/e925/0900766b814c54cb.pdf; PACKAGE: 0805 (2012M); VALUE: 10k
SWD = Connector:PINHD-1X5: PIN HEADER; CATEGORY: CONNECTOR; SUB-CATEGORY: PIN-HEADER
U$1 = BA Parts:STM32F446ZE
U$2 U$4 = BA Parts:BUTTON_6MM
U$5 = BA Parts:RES_SMD: SMD Widerstand; DATASHEET: https://docs.rs-online.com/e925/0900766b814c54cb.pdf; PACKAGE: 0805 (2012M)